# EAGLE design cblock (EAGLE 6.6.0)
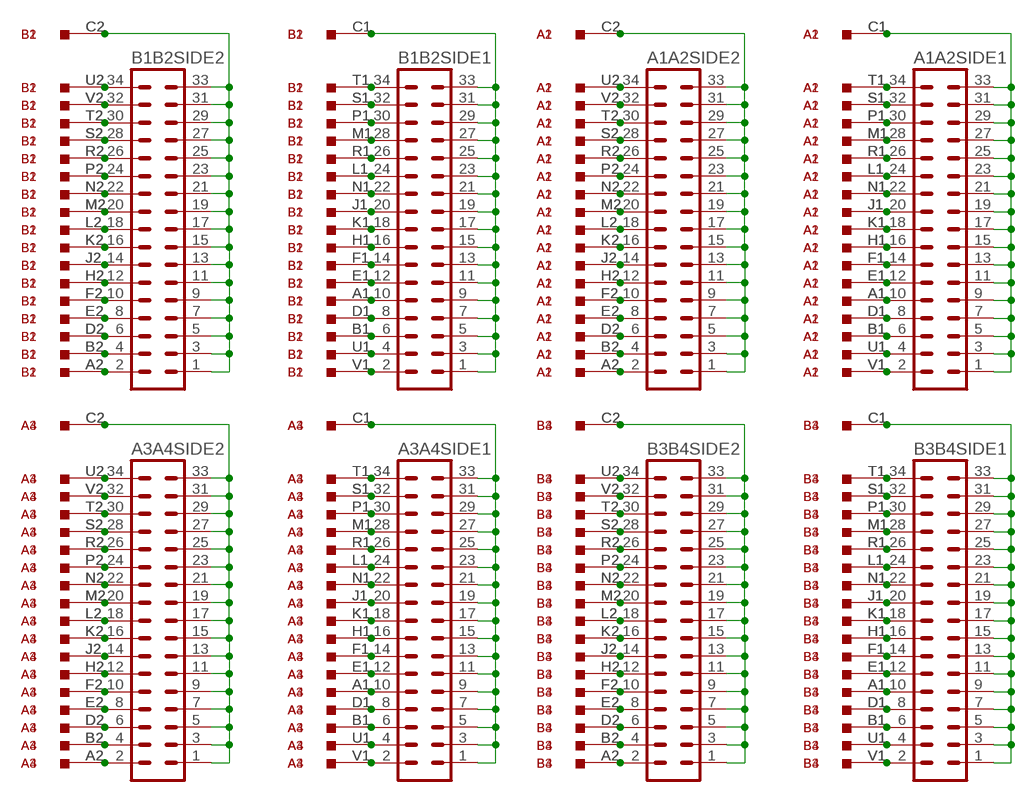
[diagram p0: schematic, sheet 1]

## Parts
A1  M916  [H807]
A1A2SIDE1  MA17-2  [MA17-2]
A1A2SIDE2  MA17-2  [MA17-2]
A2  M916  [H807]
A3  M916  [H807]
A3A4SIDE1  MA17-2  [MA17-2]
A3A4SIDE2  MA17-2  [MA17-2]
A4  M916  [H807]
B1  M916  [H807]
B1B2SIDE1  MA17-2  [MA17-2]
B1B2SIDE2  MA17-2  [MA17-2]
B2  M916  [H807]
B3  M916  [H807]
B3B4SIDE1  MA17-2  [MA17-2]
B3B4SIDE2  MA17-2  [MA17-2]
B4  M916  [H807]

## Nets
N$1: B1.C2 B1B2SIDE2.1 B1B2SIDE2.3 B1B2SIDE2.5 B1B2SIDE2.7 B1B2SIDE2.9 B1B2SIDE2.11 B1B2SIDE2.13 B1B2SIDE2.15 B1B2SIDE2.17 B1B2SIDE2.19 B1B2SIDE2.21 B1B2SIDE2.23 B1B2SIDE2.25 B1B2SIDE2.27 B1B2SIDE2.29 B1B2SIDE2.31 B1B2SIDE2.33 B2.C2
N$2: B1.A2 B1B2SIDE2.2 B2.A2
N$3: B1.B2 B1B2SIDE2.4 B2.B2
N$4: B1.D2 B1B2SIDE2.6 B2.D2
N$5: B1.E2 B1B2SIDE2.8 B2.E2
N$6: B1.F2 B1B2SIDE2.10 B2.F2
N$7: B1.H2 B1B2SIDE2.12 B2.H2
N$8: B1.J2 B1B2SIDE2.14 B2.J2
N$9: B1.K2 B1B2SIDE2.16 B2.K2
N$10: B1.L2 B1B2SIDE2.18 B2.L2
N$11: B1.M2 B1B2SIDE2.20 B2.M2
N$12: B1.N2 B1B2SIDE2.22 B2.N2
N$13: B1.P2 B1B2SIDE2.24 B2.P2
N$14: B1.R2 B1B2SIDE2.26 B2.R2
N$15: B1.S2 B1B2SIDE2.28 B2.S2
N$16: B1.T2 B1B2SIDE2.30 B2.T2
N$17: B1.U2 B1B2SIDE2.34 B2.U2
N$18: B1.V2 B1B2SIDE2.32 B2.V2
N$19: B1.A1 B1B2SIDE1.10 B2.A1
N$20: B1.B1 B1B2SIDE1.6 B2.B1
N$21: B1.D1 B1B2SIDE1.8 B2.D1
N$22: B1.E1 B1B2SIDE1.12 B2.E1
N$23: B1.F1 B1B2SIDE1.14 B2.F1
N$24: B1.H1 B1B2SIDE1.16 B2.H1
N$25: B1.J1 B1B2SIDE1.20 B2.J1
N$26: B1.K1 B1B2SIDE1.18 B2.K1
N$27: B1.L1 B1B2SIDE1.24 B2.L1
N$28: B1.M1 B1B2SIDE1.28 B2.M1
N$29: B1.N1 B1B2SIDE1.22 B2.N1
N$30: B1.P1 B1B2SIDE1.30 B2.P1
N$31: B1.R1 B1B2SIDE1.26 B2.R1
N$32: B1.S1 B1B2SIDE1.32 B2.S1
N$33: B1.T1 B1B2SIDE1.34 B2.T1
N$34: B1.U1 B1B2SIDE1.4 B2.U1
N$35: B1.V1 B1B2SIDE1.2 B2.V1
N$36: B1.C1 B1B2SIDE1.1 B1B2SIDE1.3 B1B2SIDE1.5 B1B2SIDE1.7 B1B2SIDE1.9 B1B2SIDE1.11 B1B2SIDE1.13 B1B2SIDE1.15 B1B2SIDE1.17 B1B2SIDE1.19 B1B2SIDE1.21 B1B2SIDE1.23 B1B2SIDE1.25 B1B2SIDE1.27 B1B2SIDE1.29 B1B2SIDE1.31 B1B2SIDE1.33 B2.C1
N$37: A1.C2 A1A2SIDE2.1 A1A2SIDE2.3 A1A2SIDE2.5 A1A2SIDE2.7 A1A2SIDE2.9 A1A2SIDE2.11 A1A2SIDE2.13 A1A2SIDE2.15 A1A2SIDE2.17 A1A2SIDE2.19 A1A2SIDE2.21 A1A2SIDE2.23 A1A2SIDE2.25 A1A2SIDE2.27 A1A2SIDE2.29 A1A2SIDE2.31 A1A2SIDE2.33 A2.C2
N$38: A1.A2 A1A2SIDE2.2 A2.A2
N$39: A1.B2 A1A2SIDE2.4 A2.B2
N$40: A1.D2 A1A2SIDE2.6 A2.D2
N$41: A1.E2 A1A2SIDE2.8 A2.E2
N$42: A1.F2 A1A2SIDE2.10 A2.F2
N$43: A1.H2 A1A2SIDE2.12 A2.H2
N$44: A1.J2 A1A2SIDE2.14 A2.J2
N$45: A1.K2 A1A2SIDE2.16 A2.K2
N$46: A1.L2 A1A2SIDE2.18 A2.L2
N$47: A1.M2 A1A2SIDE2.20 A2.M2
N$48: A1.N2 A1A2SIDE2.22 A2.N2
N$49: A1.P2 A1A2SIDE2.24 A2.P2
N$50: A1.R2 A1A2SIDE2.26 A2.R2
N$51: A1.S2 A1A2SIDE2.28 A2.S2
N$52: A1.T2 A1A2SIDE2.30 A2.T2
N$53: A1.U2 A1A2SIDE2.34 A2.U2
N$54: A1.V2 A1A2SIDE2.32 A2.V2
N$55: A1.A1 A1A2SIDE1.10 A2.A1
N$56: A1.B1 A1A2SIDE1.6 A2.B1
N$57: A1.D1 A1A2SIDE1.8 A2.D1
N$58: A1.E1 A1A2SIDE1.12 A2.E1
N$59: A1.F1 A1A2SIDE1.14 A2.F1
N$60: A1.H1 A1A2SIDE1.16 A2.H1
N$61: A1.J1 A1A2SIDE1.20 A2.J1
N$62: A1.K1 A1A2SIDE1.18 A2.K1
N$63: A1.L1 A1A2SIDE1.24 A2.L1
N$64: A1.M1 A1A2SIDE1.28 A2.M1
N$65: A1.N1 A1A2SIDE1.22 A2.N1
N$66: A1.P1 A1A2SIDE1.30 A2.P1
N$67: A1.R1 A1A2SIDE1.26 A2.R1
N$68: A1.S1 A1A2SIDE1.32 A2.S1
N$69: A1.T1 A1A2SIDE1.34 A2.T1
N$70: A1.U1 A1A2SIDE1.4 A2.U1
N$71: A1.V1 A1A2SIDE1.2 A2.V1
N$72: A1.C1 A1A2SIDE1.1 A1A2SIDE1.3 A1A2SIDE1.5 A1A2SIDE1.7 A1A2SIDE1.9 A1A2SIDE1.11 A1A2SIDE1.13 A1A2SIDE1.15 A1A2SIDE1.17 A1A2SIDE1.19 A1A2SIDE1.21 A1A2SIDE1.23 A1A2SIDE1.25 A1A2SIDE1.27 A1A2SIDE1.29 A1A2SIDE1.31 A1A2SIDE1.33 A2.C1
N$145: A3.C2 A3A4SIDE2.1 A3A4SIDE2.3 A3A4SIDE2.5 A3A4SIDE2.7 A3A4SIDE2.9 A3A4SIDE2.11 A3A4SIDE2.13 A3A4SIDE2.15 A3A4SIDE2.17 A3A4SIDE2.19 A3A4SIDE2.21 A3A4SIDE2.23 A3A4SIDE2.25 A3A4SIDE2.27 A3A4SIDE2.29 A3A4SIDE2.31 A3A4SIDE2.33 A4.C2
N$146: A3.A2 A3A4SIDE2.2 A4.A2
N$147: A3.B2 A3A4SIDE2.4 A4.B2
N$148: A3.D2 A3A4SIDE2.6 A4.D2
N$149: A3.E2 A3A4SIDE2.8 A4.E2
N$150: A3.F2 A3A4SIDE2.10 A4.F2
N$151: A3.H2 A3A4SIDE2.12 A4.H2
N$152: A3.J2 A3A4SIDE2.14 A4.J2
N$153: A3.K2 A3A4SIDE2.16 A4.K2
N$154: A3.L2 A3A4SIDE2.18 A4.L2
N$155: A3.M2 A3A4SIDE2.20 A4.M2
N$156: A3.N2 A3A4SIDE2.22 A4.N2
N$157: A3.P2 A3A4SIDE2.24 A4.P2
N$158: A3.R2 A3A4SIDE2.26 A4.R2
N$159: A3.S2 A3A4SIDE2.28 A4.S2
N$160: A3.T2 A3A4SIDE2.30 A4.T2
N$161: A3.U2 A3A4SIDE2.34 A4.U2
N$162: A3.V2 A3A4SIDE2.32 A4.V2
N$163: A3.A1 A3A4SIDE1.10 A4.A1
N$164: A3.B1 A3A4SIDE1.6 A4.B1
N$165: A3.D1 A3A4SIDE1.8 A4.D1
N$166: A3.E1 A3A4SIDE1.12 A4.E1
N$167: A3.F1 A3A4SIDE1.14 A4.F1
N$168: A3.H1 A3A4SIDE1.16 A4.H1
N$169: A3.J1 A3A4SIDE1.20 A4.J1
N$170: A3.K1 A3A4SIDE1.18 A4.K1
N$171: A3.L1 A3A4SIDE1.24 A4.L1
N$172: A3.M1 A3A4SIDE1.28 A4.M1
N$173: A3.N1 A3A4SIDE1.22 A4.N1
N$174: A3.P1 A3A4SIDE1.30 A4.P1
N$175: A3.R1 A3A4SIDE1.26 A4.R1
N$176: A3.S1 A3A4SIDE1.32 A4.S1
N$177: A3.T1 A3A4SIDE1.34 A4.T1
N$178: A3.U1 A3A4SIDE1.4 A4.U1
N$179: A3.V1 A3A4SIDE1.2 A4.V1
N$180: A3.C1 A3A4SIDE1.1 A3A4SIDE1.3 A3A4SIDE1.5 A3A4SIDE1.7 A3A4SIDE1.9 A3A4SIDE1.11 A3A4SIDE1.13 A3A4SIDE1.15 A3A4SIDE1.17 A3A4SIDE1.19 A3A4SIDE1.21 A3A4SIDE1.23 A3A4SIDE1.25 A3A4SIDE1.27 A3A4SIDE1.29 A3A4SIDE1.31 A3A4SIDE1.33 A4.C1
N$253: B3.C2 B3B4SIDE2.1 B3B4SIDE2.3 B3B4SIDE2.5 B3B4SIDE2.7 B3B4SIDE2.9 B3B4SIDE2.11 B3B4SIDE2.13 B3B4SIDE2.15 B3B4SIDE2.17 B3B4SIDE2.19 B3B4SIDE2.21 B3B4SIDE2.23 B3B4SIDE2.25 B3B4SIDE2.27 B3B4SIDE2.29 B3B4SIDE2.31 B3B4SIDE2.33 B4.C2
N$254: B3.A2 B3B4SIDE2.2 B4.A2
N$255: B3.B2 B3B4SIDE2.4 B4.B2
N$256: B3.D2 B3B4SIDE2.6 B4.D2
N$257: B3.E2 B3B4SIDE2.8 B4.E2
N$258: B3.F2 B3B4SIDE2.10 B4.F2
N$259: B3.H2 B3B4SIDE2.12 B4.H2
N$260: B3.J2 B3B4SIDE2.14 B4.J2
N$261: B3.K2 B3B4SIDE2.16 B4.K2
N$262: B3.L2 B3B4SIDE2.18 B4.L2
N$263: B3.M2 B3B4SIDE2.20 B4.M2
N$264: B3.N2 B3B4SIDE2.22 B4.N2
N$265: B3.P2 B3B4SIDE2.24 B4.P2
N$266: B3.R2 B3B4SIDE2.26 B4.R2
N$267: B3.S2 B3B4SIDE2.28 B4.S2
N$268: B3.T2 B3B4SIDE2.30 B4.T2
N$269: B3.U2 B3B4SIDE2.34 B4.U2
N$270: B3.V2 B3B4SIDE2.32 B4.V2
N$271: B3.A1 B3B4SIDE1.10 B4.A1
N$272: B3.B1 B3B4SIDE1.6 B4.B1
N$273: B3.D1 B3B4SIDE1.8 B4.D1
N$274: B3.E1 B3B4SIDE1.12 B4.E1
N$275: B3.F1 B3B4SIDE1.14 B4.F1
N$276: B3.H1 B3B4SIDE1.16 B4.H1
N$277: B3.J1 B3B4SIDE1.20 B4.J1
N$278: B3.K1 B3B4SIDE1.18 B4.K1
N$279: B3.L1 B3B4SIDE1.24 B4.L1
N$280: B3.M1 B3B4SIDE1.28 B4.M1
N$281: B3.N1 B3B4SIDE1.22 B4.N1
N$282: B3.P1 B3B4SIDE1.30 B4.P1
N$283: B3.R1 B3B4SIDE1.26 B4.R1
N$284: B3.S1 B3B4SIDE1.32 B4.S1
N$285: B3.T1 B3B4SIDE1.34 B4.T1
N$286: B3.U1 B3B4SIDE1.4 B4.U1
N$287: B3.V1 B3B4SIDE1.2 B4.V1
N$288: B3.C1 B3B4SIDE1.1 B3B4SIDE1.3 B3B4SIDE1.5 B3B4SIDE1.7 B3B4SIDE1.9 B3B4SIDE1.11 B3B4SIDE1.13 B3B4SIDE1.15 B3B4SIDE1.17 B3B4SIDE1.19 B3B4SIDE1.21 B3B4SIDE1.23 B3B4SIDE1.25 B3B4SIDE1.27 B3B4SIDE1.29 B3B4SIDE1.31 B3B4SIDE1.33 B4.C1

## Library data of the parts
A1-A4 B1-B4 = dec-m:M916: Simple 36 pin connector/wire cable
A1A2SIDE1 A1A2SIDE2 A3A4SIDE1 A3A4SIDE2 B1B2SIDE1 B1B2SIDE2 B3B4SIDE1 B3B4SIDE2 = con-lstb:MA17-2: PIN HEADER; OC_FARNELL: unknown; OC_NEWARK: unknown

## Net classes
1 Power: width 0.305 mm, clearance 0.305 mm

## Board
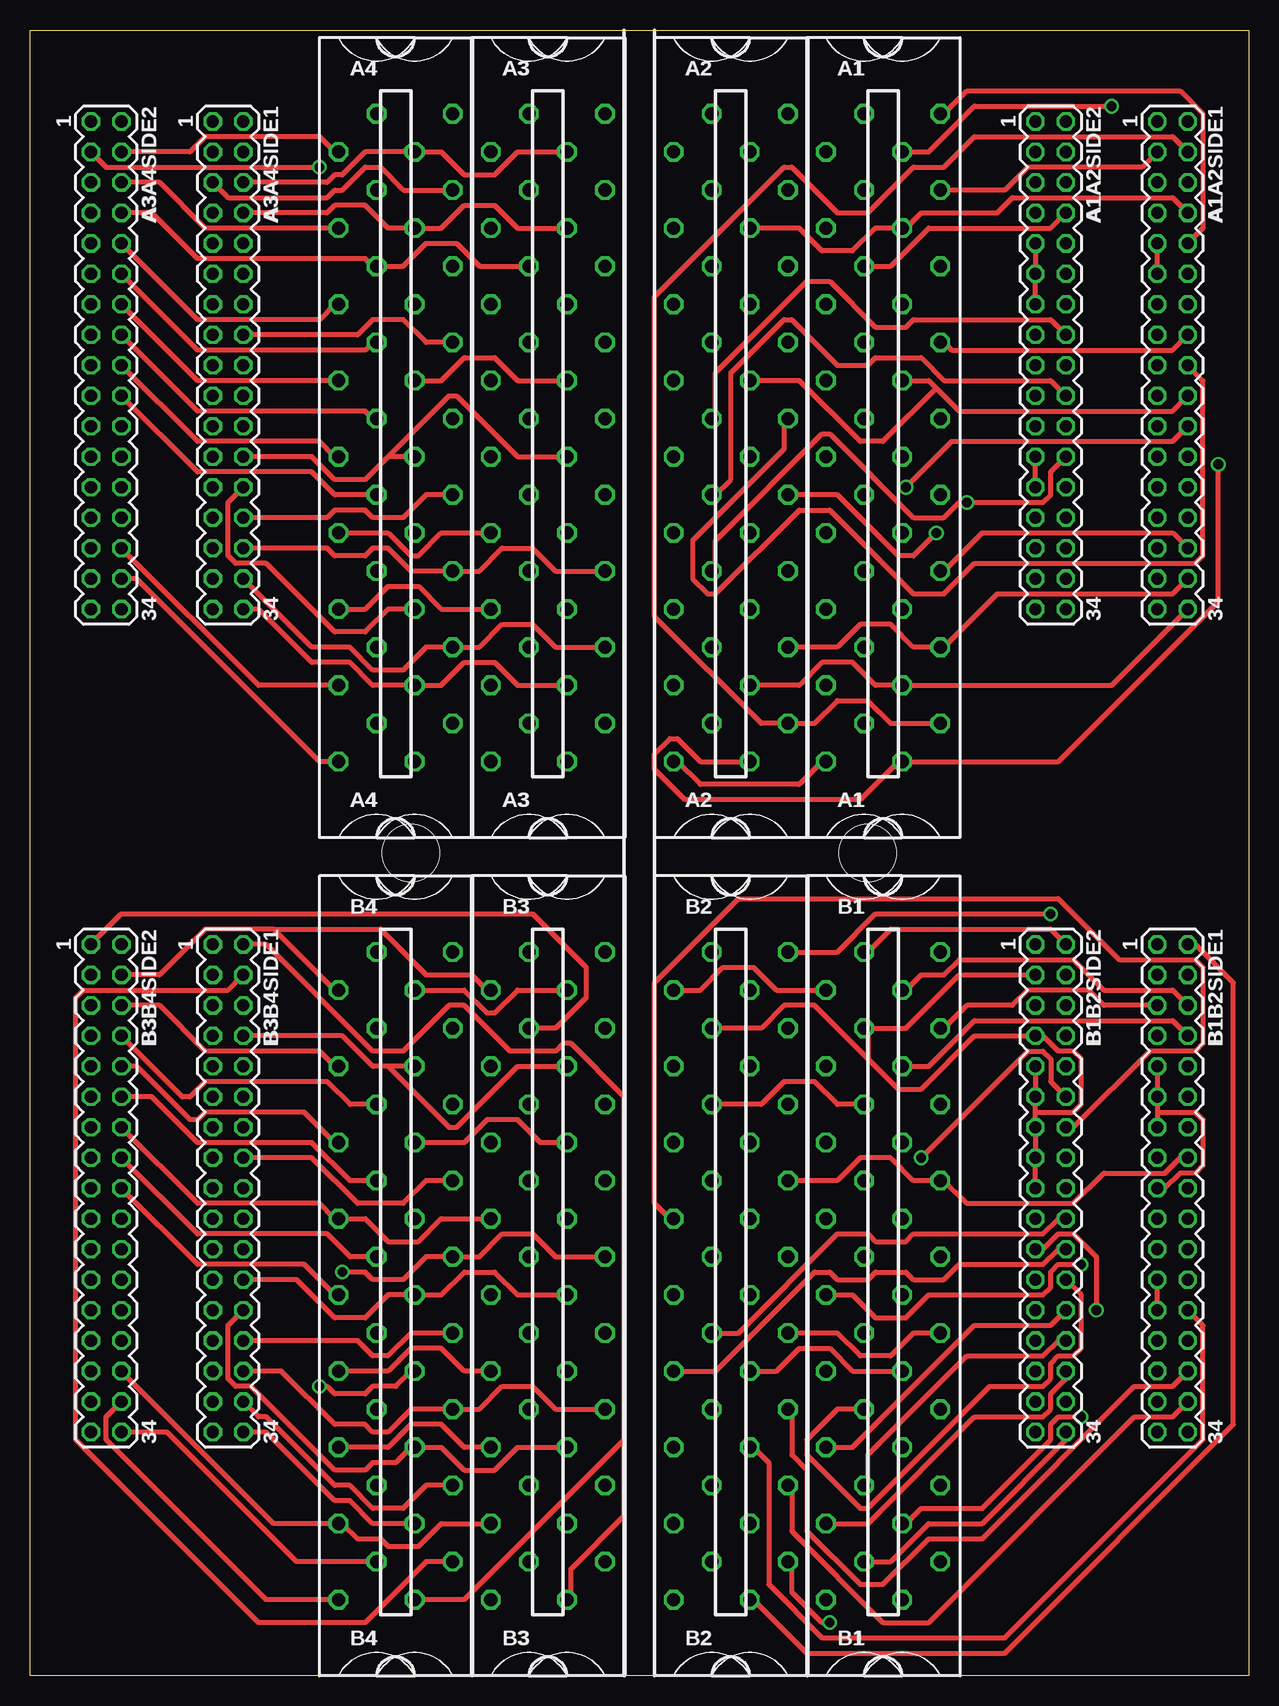
[diagram p1: board, top side]
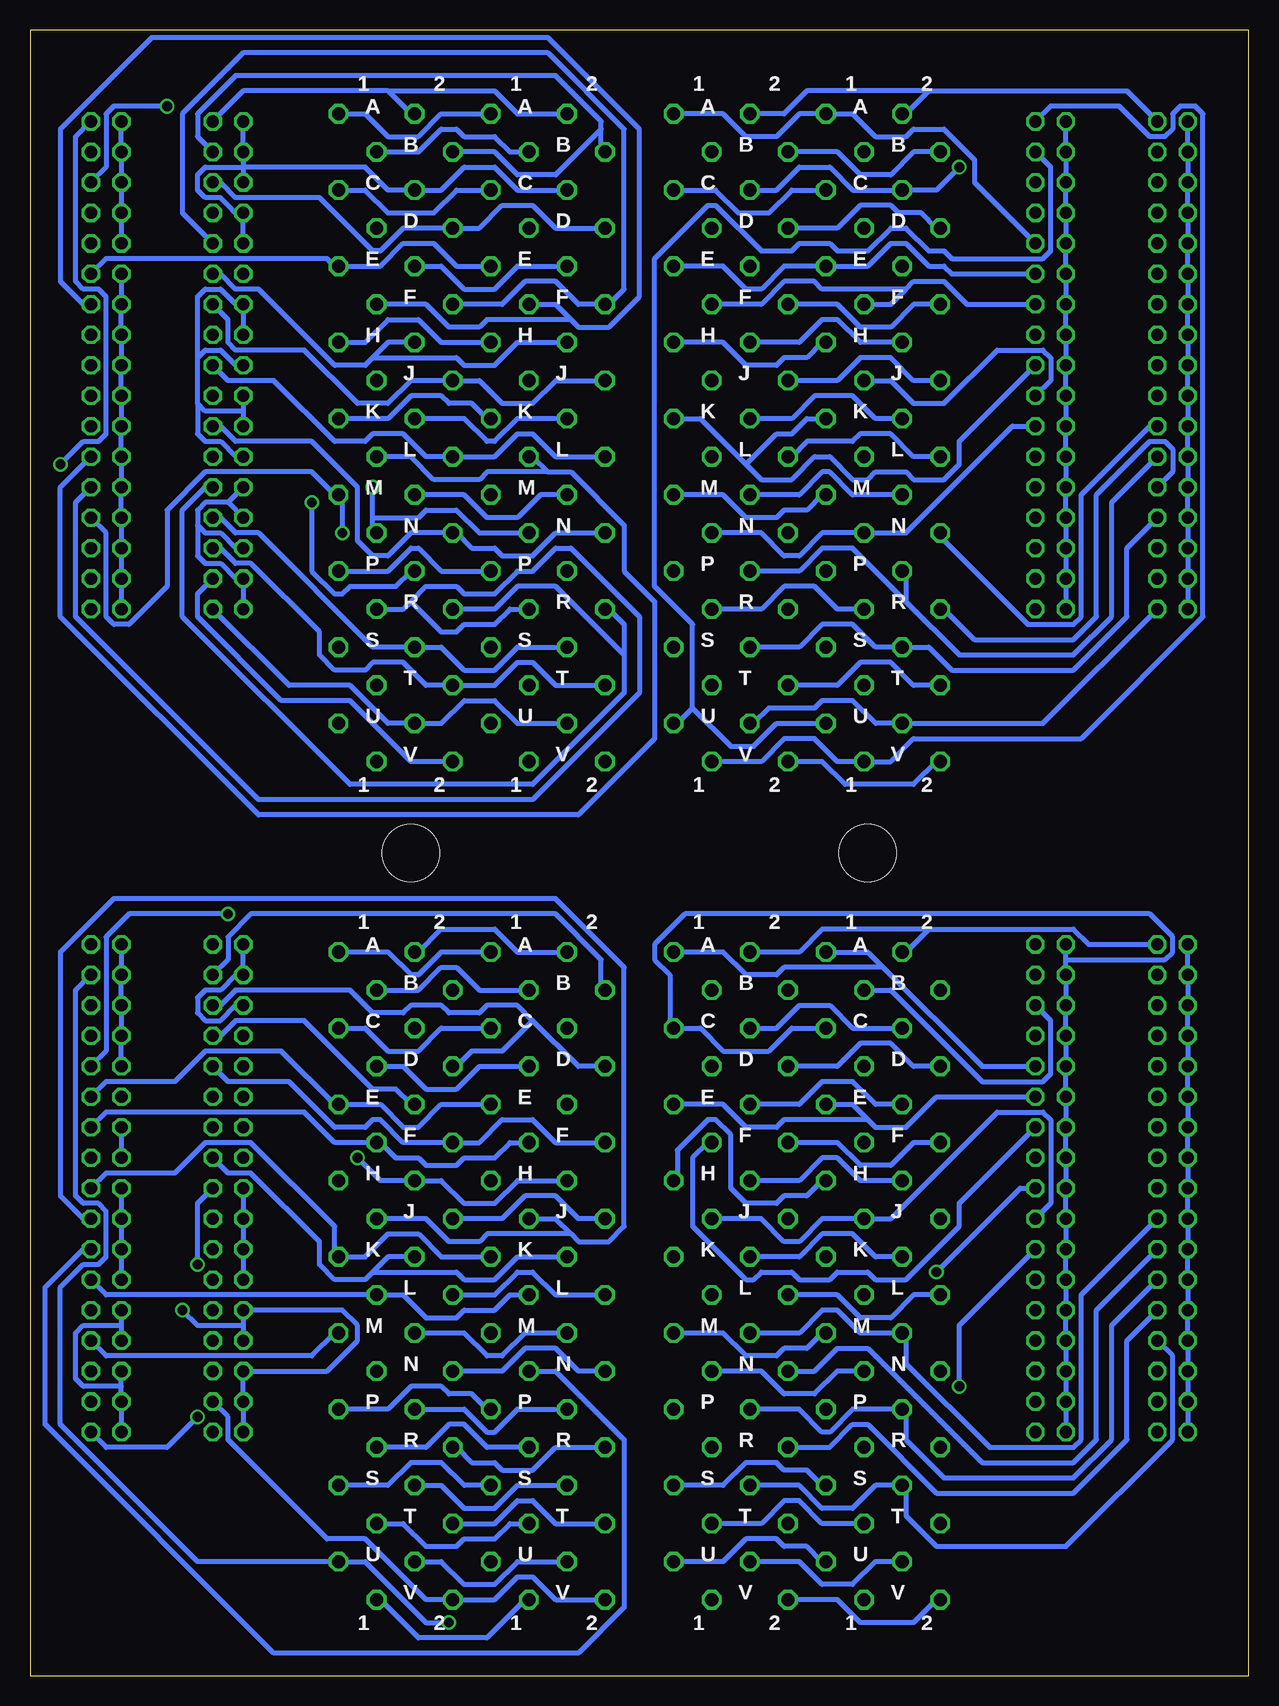
[diagram p2: board, bottom side, seen from below]

Size 101.6 x 137.16 mm. Coordinates in mm from the lower left corner, seen from the top.
Outline: 101.6,0 52.07,0 49.53,0 0,0 0,137.16 49.53,137.16 52.07,137.16 101.6,137.16 101.6,0
Copper layers (1+16): Top 0.035mm / dielectric 1.5mm / Bottom 0.035mm
Design rules "16mils": minimum track width 16mil, minimum drill 32mil, track to track 15mil, track to pad 10mil, pad to pad 10mil, via to via 10mil, smd to smd 10mil, copper to edge 13mil, drill to drill 10mil, minimum pad ring 10mil, minimum via ring 8mil, stop-mask expansion 0mil, vias tented up to drill 0mil, thermal gap 10mil
Holes 4.78 mm at 31.75,68.58 69.85,68.58

### Footprints (pad centres in the part's own frame; a part is rotated, then mirrored left to right if it is on the bottom)
H807 = drill 1.092 octagon: A1 4.763,28.575; A2 -1.587,28.575; B1 1.587,25.4; B2 -4.763,25.4; C1 4.763,22.225; C2 -1.587,22.225; D1 1.587,19.05; D2 -4.763,19.05; E1 4.763,15.875; E2 -1.587,15.875; F1 1.587,12.7; F2 -4.763,12.7; H1 4.763,9.525; H2 -1.587,9.525; J1 1.587,6.35; J2 -4.763,6.35; K1 4.763,3.175; K2 -1.587,3.175; L1 1.587,0; L2 -4.763,0; M1 4.763,-3.175; M2 -1.587,-3.175; N1 1.587,-6.35; N2 -4.763,-6.35; P1 4.763,-9.525; P2 -1.587,-9.525; R1 1.587,-12.7; R2 -4.763,-12.7; S1 4.763,-15.875; S2 -1.587,-15.875; T1 1.587,-19.05; T2 -4.763,-19.05; U1 4.763,-22.225; U2 -1.587,-22.225; V1 1.587,-25.4; V2 -4.763,-25.4
MA17-2 = drill 1.016 octagon: 1 -20.32,-1.27; 2 -20.32,1.27; 3 -17.78,-1.27; 4 -17.78,1.27; 5 -15.24,-1.27; 6 -15.24,1.27; 7 -12.7,-1.27; 8 -12.7,1.27; 9 -10.16,-1.27; 10 -10.16,1.27; 11 -7.62,-1.27; 12 -7.62,1.27; 13 -5.08,-1.27; 14 -5.08,1.27; 15 -2.54,-1.27; 16 -2.54,1.27; 17 0,-1.27; 18 0,1.27; 19 2.54,-1.27; 20 2.54,1.27; 21 5.08,-1.27; 22 5.08,1.27; 23 7.62,-1.27; 24 7.62,1.27; 25 10.16,-1.27; 26 10.16,1.27; 27 12.7,-1.27; 28 12.7,1.27; 29 15.24,-1.27; 30 15.24,1.27; 31 17.78,-1.27; 32 17.78,1.27; 33 20.32,-1.27; 34 20.32,1.27

### Placement (x,y rotation side)
A1  71.12,101.6 0 top
A1A2SIDE1  95.25,109.22 270 top
A1A2SIDE2  85.09,109.22 270 top
A2  58.42,101.6 0 top
A3  43.18,101.6 0 top
A3A4SIDE1  16.51,109.22 270 top
A3A4SIDE2  6.35,109.22 270 top
A4  30.48,101.6 0 top
B1  71.12,31.75 0 top
B1B2SIDE1  95.25,40.64 270 top
B1B2SIDE2  85.09,40.64 270 top
B2  58.42,31.75 0 top
B3  43.18,31.75 0 top
B3B4SIDE1  16.51,40.64 270 top
B3B4SIDE2  6.35,40.64 270 top
B4  30.48,31.75 0 top

### Tracks (layer width: path | path; a pad name or v marks a point on that pad's centre or on a via)
N$1  (via drill 0.81)
  Top 0.406: 69.85,51.44 72.39,48.9 74.3,48.9 78.74,53.34 B1B2SIDE2.7 84.45,53.34 85.72,52.07 87,52.07 87.63,51.44 87.63,47.62 87,46.99 83.82,46.99 | 69.85,53.98 69.85,51.44 | B2.C2 60.96,53.98 62.87,55.88 65.41,55.88 69.85,51.44 | B1B2SIDE2.3 77.47,58.42 73.03,53.98 69.85,53.98 | 69.85,53.98 B1.C2 | B1B2SIDE2.9 B1B2SIDE2.11 83.82,46.99 | B1B2SIDE2.17 B1B2SIDE2.15 B1B2SIDE2.13 83.82,46.99 | v88.9,30.48 88.9,34.92 87,36.83 85.72,36.83 84.45,35.56 B1B2SIDE2.21
  Bottom 0.406: B1B2SIDE2.5 84.45,55.88 85.72,54.61 87,54.61 87.63,55.24 87.63,56.52 87,57.15 85.72,57.15 84.45,58.42 B1B2SIDE2.3 B1B2SIDE2.1 | 83.82,29.21 B1B2SIDE2.25 75.56,30.48 74.3,29.21 74.3,27.94 76.83,25.4 B1B2SIDE2.29 B1B2SIDE2.31 B1B2SIDE2.33 | 83.82,29.21 B1B2SIDE2.27 | B1B2SIDE2.23 B1B2SIDE2.21 B1B2SIDE2.19 B1B2SIDE2.17 | 83.82,29.21 87.63,29.21 v88.9,30.48
N$2
  Top 0.406: B1B2SIDE2.2 85.09,62.23 71.75,62.23 69.85,60.33 B1.A2
  Bottom 0.406: B2.A2 60.96,60.33 62.87,62.23 67.31,62.23 69.22,60.33 B1.A2
N$3
  Top 0.406: B1.B2 62.23,57.15 60.33,59.05 57.78,59.05 55.88,57.15 B2.B2
  Bottom 0.406: B1B2SIDE2.4 85.09,59.69 85.09,61.59 83.19,63.5 57.78,63.5 53.98,59.69 53.98,57.15 B2.B2
N$4
  Bottom 0.406: B1B2SIDE2.6 85.72,55.88 84.45,57.15 74.93,57.15 73.03,55.24 70.48,55.24 69.85,55.88 67.31,55.88 66.67,55.24 64.14,55.24 63.5,55.88 60.96,55.88 59.69,54.61 | 59.69,54.61 55.88,50.8 B2.D2 | 59.69,54.61 62.23,52.07 64.77,52.07 66.04,50.8 B1.D2
N$5
  Top 0.406: B2.E2 60.96,47.62 62.87,49.53 65.41,49.53 67.31,47.62 B1.E2
  Bottom 0.406: B1B2SIDE2.8 85.72,53.34 84.45,54.61 78.74,54.61 73.03,48.9 71.12,48.9 69.85,47.62 B1.E2
N$6
  Bottom 0.406: B1B2SIDE2.10 85.09,49.53 80.01,49.53 76.2,45.72 73.66,45.72 73.03,46.35 72.39,46.35 70.48,44.45 B1.F2 64.14,44.45 62.23,46.35 59.69,46.35 57.78,44.45 B2.F2
N$7  (via drill 0.81)
  Top 0.406: B1B2SIDE2.12 85.09,49.53 85.09,51.44 84.45,52.07 83.19,52.07 v74.3,43.18
  Bottom 0.406: v74.3,43.18 72.39,41.27 B1.H2 67.31,41.27 65.41,39.37 62.87,39.37 60.96,41.27 B2.H2
N$8
  Top 0.406: B1B2SIDE2.14 87,45.72 93.34,52.07 97.16,52.07 97.79,52.7 97.79,59.05 97.16,59.69 90.81,59.69 85.72,64.77 59.05,64.77 52.07,57.78 52.07,39.37 53.34,38.1 B2.J2
  Bottom 0.406: B1.J2 62.23,38.1 60.33,40.01 57.78,40.01 55.88,38.1 B2.J2
N$9
  Bottom 0.406: B1B2SIDE2.16 85.09,41.91 83.19,41.91 77.47,36.2 77.47,34.29 76.2,33.02 73.66,33.02 73.03,33.66 | 73.03,33.66 71.75,34.92 B1.K2 | B2.K2 60.96,34.92 62.87,33.02 65.41,33.02 66.04,33.66 73.03,33.66
N$10  (via drill 0.81)
  Top 0.406: v87.63,34.29 85.72,34.29 85.09,33.66 85.09,32.38 84.45,31.75 74.93,31.75 73.03,29.84 70.48,29.84 68.58,31.75 B1.L2
  Bottom 0.406: B1B2SIDE2.18 87.63,39.37 v87.63,34.29 | B2.L2 57.78,31.75 59.69,33.66 60.96,33.66 62.87,31.75 B1.L2
N$11
  Top 0.406: B1B2SIDE2.20 85.72,38.1 84.45,36.83 73.66,36.83 73.03,36.2 70.48,36.2 69.85,36.83 67.31,36.83 59.05,28.57 B2.M2
  Bottom 0.406: B1.M2 65.41,28.57 63.5,26.67 62.23,26.67 60.33,28.57 B2.M2
N$12
  Top 0.406: B1B2SIDE2.22 85.72,35.56 84.45,34.29 77.47,34.29 76.2,33.02 73.66,33.02 73.03,33.66 70.48,33.66 69.85,33.02 67.31,33.02 66.67,33.66 65.41,33.66 57.15,25.4 B2.N2
  Bottom 0.406: B1.N2 62.23,25.4 60.33,27.3 57.78,27.3 55.88,25.4 B2.N2
N$13
  Top 0.406: B1B2SIDE2.24 87.63,31.75 87.63,27.3 87,26.67 85.72,26.67 85.09,26.04 85.09,24.77 84.45,24.13 80.01,24.13 69.85,13.97 69.22,13.97 64.77,18.41 64.77,19.68 67.31,22.23 B1.P2
  Bottom 0.406: B2.P2 60.96,22.23 62.87,20.32 63.5,20.32 65.41,22.23 B1.P2
N$14
  Top 0.406: B1B2SIDE2.26 85.09,29.21 78.74,29.21 68.58,19.05 B1.R2
  Bottom 0.406: B2.R2 57.78,19.05 59.69,17.14 62.23,17.14 62.87,17.78 64.77,17.78 66.04,19.05 B1.R2
N$15
  Top 0.406: B1B2SIDE2.28 85.72,27.94 84.45,26.67 78.11,26.67 69.85,18.41 69.85,15.88 B1.S2
  Bottom 0.406: B2.S2 60.96,15.88 62.87,13.97 65.41,13.97 67.31,15.88 B1.S2
N$16
  Top 0.406: B1B2SIDE2.30 86.36,24.77 85.09,23.5 85.09,22.23 84.45,21.59 78.74,21.59 69.85,12.7 B1.T2
  Bottom 0.406: B2.T2 57.78,12.7 59.69,14.61 60.96,14.61 62.87,12.7 B1.T2
N$17
  Top 0.406: B1B2SIDE2.34 86.36,19.68 79.38,12.7 74.93,12.7 71.75,9.53 B1.U2
  Bottom 0.406: B2.U2 60.96,9.53 62.87,7.62 65.41,7.62 67.31,9.53 B1.U2
N$18
  Bottom 0.406: B1B2SIDE2.32 85.09,21.59 85.09,19.68 76.83,11.43 73.66,11.43 68.58,6.35 B1.V2 62.87,6.35 60.96,8.26 59.69,8.26 57.78,6.35 B2.V2
N$19  (via drill 0.81)
  Top 0.406: v85.09,63.5 70.48,63.5 67.31,60.33 B2.A1
  Bottom 0.406: B1B2SIDE1.10 95.25,52.07 95.25,61.59 93.34,63.5 v85.09,63.5 | B1.A1 71.75,60.33 69.85,58.42 69.22,58.42 67.31,60.33 B2.A1
N$20
  Top 0.406: B1B2SIDE1.6 95.25,57.15 89.53,57.15 87,59.69 77.47,59.69 76.2,58.42 74.3,58.42 73.03,57.15 B1.B1
  Bottom 0.406: B2.B1 64.14,57.15 66.04,59.05 67.31,59.05 69.22,57.15 B1.B1
N$21
  Top 0.406: B1B2SIDE1.8 95.25,54.61 78.74,54.61 74.93,50.8 B1.D1
  Bottom 0.406: B2.D1 64.14,50.8 66.04,48.9 68.58,48.9 70.48,50.8 B1.D1
N$22
  Bottom 0.406: B1B2SIDE1.12 95.25,49.53 89.53,49.53 87,52.07 80.64,52.07 76.2,47.62 B1.E1 72.39,47.62 70.48,45.72 69.22,45.72 67.31,47.62 B2.E1
N$23
  Bottom 0.406: B1B2SIDE1.14 95.25,46.99 78.74,46.99 76.2,44.45 B1.F1 72.39,44.45 71.12,43.18 69.22,43.18 68.58,42.55 66.04,42.55 65.41,43.18 62.87,43.18 61.59,44.45 B2.F1
N$24
  Top 0.406: B1B2SIDE1.16 95.89,43.18 94.61,41.91 89.53,41.91 87,39.37 78.11,39.37 76.2,41.27 B1.H1 73.66,41.27 71.75,43.18 69.22,43.18 67.31,41.27 B2.H1
N$25
  Bottom 0.406: B1B2SIDE1.20 97.16,38.1 99.06,40.01 99.06,60.33 94.61,64.77 57.78,64.77 52.07,59.05 52.07,37.47 53.34,36.2 55.88,36.2 56.52,36.83 | 56.52,36.83 57.78,38.1 B2.J1 | B1.J1 68.58,38.1 66.67,36.2 64.14,36.2 63.5,36.83 56.52,36.83
N$26
  Bottom 0.406: B1B2SIDE1.18 95.25,41.91 89.53,41.91 87,44.45 83.19,44.45 76.2,37.47 76.2,34.92 B1.K1 73.66,34.92 71.75,36.83 69.22,36.83 67.31,34.92 B2.K1
N$27
  Bottom 0.406: B1B2SIDE1.24 95.25,31.75 B1.L1 70.48,31.75 68.58,29.84 66.04,29.84 65.41,30.48 62.87,30.48 61.59,31.75 B2.L1
N$28
  Top 0.406: B2.M1 67.31,28.57 69.22,26.67 71.75,26.67 73.66,28.57 B1.M1
  Bottom 0.406: B1B2SIDE1.28 95.25,26.67 78.11,26.67 76.2,28.57 B1.M1
N$29
  Top 0.406: B1.N1 68.58,25.4 66.67,27.3 64.14,27.3 62.23,25.4 B2.N1
  Bottom 0.406: B1B2SIDE1.22 97.16,35.56 100.33,32.38 100.33,20.95 81.28,1.91 55.88,1.91 52.07,5.71 52.07,19.68 57.78,25.4 B2.N1
N$30
  Top 0.406: B1B2SIDE1.30 95.25,24.13 92.08,24.13 79.38,11.43 74.93,11.43 71.12,7.62 69.22,7.62 64.77,12.06 64.77,17.14 63.5,18.41 63.5,22.23 B2.P1
  Bottom 0.406: B1.P1 71.75,22.23 69.85,24.13 67.31,24.13 66.67,23.5 64.77,23.5 63.5,22.23 B2.P1
N$31
  Top 0.406: B1B2SIDE1.26 97.79,29.21 97.79,19.68 81.28,3.17 66.04,3.17 61.59,7.62 61.59,17.78 60.33,19.05 B2.R1
  Bottom 0.406: B1.R1 68.58,19.05 66.67,20.95 65.41,20.95 63.5,19.05 B2.R1
N$32
  Top 0.406: B1B2SIDE1.32 95.25,21.59 92.08,21.59 74.93,4.45 71.12,4.45 63.5,12.06 63.5,15.88 B2.S1
  Bottom 0.406: B1.S1 71.75,15.88 69.85,17.78 67.31,17.78 65.41,15.88 B2.S1
N$33  (via drill 0.81)
  Top 0.406: v87.63,21.59 85.72,21.59 85.09,20.95 85.09,19.68 79.38,13.97 74.3,13.97 73.03,12.7 B1.T1
  Bottom 0.406: B1B2SIDE1.34 95.25,19.05 90.17,19.05 v87.63,21.59 | B2.T1 61.59,12.7 62.87,11.43 65.41,11.43 66.04,10.79 68.58,10.79 70.48,12.7 B1.T1
N$34  (via drill 0.81)
  Top 0.406: v66.67,4.45 66.04,4.45 63.5,6.99 63.5,9.53 B2.U1
  Bottom 0.406: B1B2SIDE1.4 97.79,57.15 97.79,40.01 97.16,39.37 95.89,39.37 95.25,38.73 95.25,34.92 95.89,34.29 97.16,34.29 99.06,32.38 99.06,20.95 87.63,9.53 B1.U1 73.66,9.53 68.58,4.45 v66.67,4.45
N$35
  Top 0.406: B1B2SIDE1.2 97.16,60.96 100.33,57.78 100.33,20.95 81.28,1.91 64.77,1.91 60.33,6.35 B2.V1
  Bottom 0.406: B1.V1 72.39,6.35 69.22,3.17 63.5,3.17 60.33,6.35 B2.V1
N$36
  Top 0.406: B1B2SIDE1.25 B1B2SIDE1.23 | B1B2SIDE1.9 B1B2SIDE1.11 93.98,46.99 | 93.98,46.99 B1B2SIDE1.13 | B1B2SIDE1.5 89.53,55.88 88.27,57.15 83.19,57.15 81.92,55.88 78.11,55.88 76.2,53.98 B1.C1 | B1B2SIDE1.17 94.61,40.64 95.89,41.91 97.16,41.91 97.79,42.55 97.79,46.35 97.16,46.99 93.98,46.99
  Bottom 0.406: B1B2SIDE1.23 B1B2SIDE1.21 B1B2SIDE1.19 B1B2SIDE1.17 | B1B2SIDE1.25 93.98,29.21 | 93.98,29.21 B1B2SIDE1.27 | B1B2SIDE1.33 B1B2SIDE1.31 93.98,24.13 | 93.98,24.13 B1B2SIDE1.29 | 93.98,29.21 97.16,29.21 97.79,28.57 97.79,24.77 97.16,24.13 93.98,24.13 | B2.C1 67.31,53.98 69.22,52.07 71.75,52.07 73.66,53.98 B1.C1 | B1B2SIDE1.1 B1B2SIDE1.3 B1B2SIDE1.5 B1B2SIDE1.7 B1B2SIDE1.9 | B1B2SIDE1.13 B1B2SIDE1.15
N$37
  Top 0.406: A1A2SIDE2.25 A1A2SIDE2.23 | A1A2SIDE2.9 A1A2SIDE2.11 A1A2SIDE2.13
  Bottom 0.406: 83.82,125.73 A1A2SIDE2.3 A1A2SIDE2.1 | 83.82,125.73 A1A2SIDE2.5 | A2.C2 60.96,123.83 62.87,125.73 65.41,125.73 67.31,123.83 A1.C2 71.75,123.83 73.66,125.73 83.82,125.73 | A1A2SIDE2.33 A1A2SIDE2.31 84.45,91.44 85.72,92.71 87,92.71 87.63,93.34 87.63,95.89 | A1A2SIDE2.29 84.45,93.98 85.72,95.25 87,95.25 87.63,95.89 | 87.63,95.89 87.63,97.16 87,97.79 85.09,97.79 | A1A2SIDE2.25 85.09,97.79 | 85.09,97.79 A1A2SIDE2.27 | A1A2SIDE2.9 83.82,121.28 | A1A2SIDE2.15 A1A2SIDE2.13 84.45,114.3 85.72,115.57 87,115.57 87.63,114.94 87.63,109.86 | A1A2SIDE2.19 83.82,105.41 | 83.82,105.41 A1A2SIDE2.21 | A1A2SIDE2.17 84.45,109.22 85.72,110.49 87,110.49 87.63,109.86 | 87.63,106.05 87.63,109.86 | 87.63,106.05 87,105.41 83.82,105.41 | A1A2SIDE2.23 84.45,101.6 85.72,102.87 87,102.87 87.63,103.5 87.63,106.05 | 83.82,125.73 87,125.73 87.63,125.09 87.63,123.83 87,123.19 85.72,123.19 83.82,121.28 | 83.82,121.28 A1A2SIDE2.7
N$38
  Bottom 0.406: A1A2SIDE2.2 83.82,132.08 71.75,132.08 | 71.75,132.08 69.85,130.18 A1.A2 | A2.A2 60.96,130.18 62.87,132.08 71.75,132.08
N$39
  Bottom 0.406: A1A2SIDE2.4 87.63,128.27 87.63,130.18 84.45,133.35 57.78,133.35 53.98,129.54 53.98,128.91 | 53.98,128.91 53.98,127 A2.B2 | A1.B2 62.87,127 60.96,125.09 57.78,125.09 53.98,128.91
N$40
  Bottom 0.406: A1A2SIDE2.6 85.72,124.46 84.45,123.19 77.47,123.19 73.03,118.75 72.39,118.75 70.48,120.65 A1.D2 64.14,120.65 62.23,122.56 59.69,122.56 57.78,120.65 A2.D2
N$41
  Top 0.406: A1A2SIDE2.8 85.09,120.65 74.93,120.65 71.75,117.47 A1.E2
  Bottom 0.406: A2.E2 60.96,117.47 62.87,115.57 65.41,115.57 67.31,117.47 A1.E2
N$42
  Bottom 0.406: A1A2SIDE2.10 88.9,121.92 88.9,130.18 83.82,135.25 58.42,135.25 52.07,128.91 52.07,115.57 53.34,114.3 A2.F2 55.88,114.3 57.78,116.2 60.33,116.2 62.23,114.3 A1.F2
N$43
  Bottom 0.406: A1A2SIDE2.12 85.72,116.84 84.45,115.57 82.55,115.57 76.2,109.22 73.66,109.22 73.03,109.86 | 73.03,109.86 71.75,111.12 A1.H2 | A2.H2 60.96,111.12 62.87,109.22 65.41,109.22 66.04,109.86 73.03,109.86
N$44
  Bottom 0.406: A1A2SIDE2.14 85.09,113.03 85.09,111.12 84.45,110.49 78.74,110.49 74.3,106.05 71.75,106.05 69.85,107.95 A1.J2 64.14,107.95 62.23,106.05 59.69,106.05 57.78,107.95 A2.J2
N$45
  Top 0.406: A1A2SIDE2.16 85.09,113.03 73.66,113.03 73.03,112.39 70.48,112.39 66.67,116.2 64.77,116.2 57.15,108.58 57.15,104.78 A2.K2
  Bottom 0.406: A1.K2 65.41,104.78 63.5,102.87 62.87,102.87 60.96,104.78 A2.K2
N$46
  Bottom 0.406: A1A2SIDE2.18 85.09,107.95 81.28,107.95 76.2,102.87 73.66,102.87 73.03,103.5 70.48,103.5 68.58,101.6 A1.L2 62.87,101.6 60.96,103.5 59.69,103.5 57.78,101.6 A2.L2
N$47
  Top 0.406: A1A2SIDE2.20 85.09,107.95 76.2,107.95 74.3,109.86 70.48,109.86 69.85,109.22 67.31,109.22 63.5,113.03 62.87,113.03 58.42,108.58 58.42,99.69 57.15,98.42 A2.M2
  Bottom 0.406: A1.M2 65.41,98.42 63.5,96.52 60.96,96.52 59.05,98.42 A2.M2
N$48
  Bottom 0.406: A1A2SIDE2.22 85.72,104.14 84.45,102.87 78.11,102.87 74.3,99.06 74.3,94.61 73.03,93.34 71.75,93.34 69.85,95.25 A1.N2 66.04,95.25 64.77,93.98 62.87,93.98 62.23,93.34 59.69,93.34 57.78,95.25 A2.N2
N$49  (via drill 0.81)
  Top 0.406: A1A2SIDE2.24 85.09,100.33 85.09,98.42 84.45,97.79 v78.11,97.79 77.47,97.79 76.2,96.52 73.66,96.52 66.67,103.5 66.04,103.5 57.15,94.61 57.15,92.08 A2.P2
  Bottom 0.406: v78.11,97.79 78.11,92.08 76.2,90.17 75.56,90.17 74.93,90.81 71.12,90.81 69.85,92.08 A1.P2
N$50
  Bottom 0.406: A1A2SIDE2.26 87,99.06 88.9,97.16 88.9,88.27 74.93,74.3 59.69,74.3 52.07,81.92 52.07,85.09 | 52.07,85.09 52.07,87.63 53.34,88.9 A2.R2 | A1.R2 62.87,88.9 60.96,90.81 57.78,90.81 52.07,85.09
N$51
  Bottom 0.406: A1A2SIDE2.28 85.72,96.52 84.45,95.25 82.55,95.25 73.03,85.72 A1.S2 67.31,85.72 65.41,83.82 62.87,83.82 60.96,85.72 A2.S2
N$52
  Bottom 0.406: A1A2SIDE2.30 85.72,93.98 84.45,92.71 83.19,92.71 77.47,87 77.47,85.09 76.2,83.82 73.66,83.82 73.03,84.45 70.48,84.45 68.58,82.55 A1.T2 62.87,82.55 60.96,84.45 59.69,84.45 57.78,82.55 A2.T2
N$53
  Bottom 0.406: A1A2SIDE2.34 80.01,82.55 74.93,82.55 71.75,79.38 A1.U2 67.31,79.38 65.41,81.28 62.87,81.28 60.96,79.38 A2.U2
N$54
  Top 0.406: A2.V2 53.98,76.2 55.88,74.3 64.14,74.3 66.04,76.2 A1.V2
  Bottom 0.406: A1A2SIDE2.32 87.63,90.17 87.63,88.27 80.64,81.28 74.93,81.28 69.85,76.2 A1.V2
N$55
  Top 0.406: A1A2SIDE1.10 97.79,120.65 97.79,130.18 95.89,132.08 78.11,132.08 76.2,130.18 A1.A1
  Bottom 0.406: A2.A1 67.31,130.18 69.22,128.27 71.75,128.27 73.66,130.18 A1.A1
N$56  (via drill 0.81)
  Top 0.406: v90.17,130.81 78.74,130.81 74.93,127 A1.B1
  Bottom 0.406: A1A2SIDE1.6 95.25,125.73 95.25,130.18 94.61,130.81 v90.17,130.81 | A2.B1 61.59,127 62.87,128.27 65.41,128.27 66.04,128.91 67.31,128.91 69.22,127 A1.B1
N$57
  Top 0.406: A1A2SIDE1.8 95.25,123.19 81.92,123.19 80.64,121.92 74.3,121.92 73.03,120.65 A1.D1 70.48,120.65 68.58,118.75 66.04,118.75 64.14,120.65 A2.D1
N$58
  Bottom 0.406: A1A2SIDE1.12 95.25,118.11 76.83,118.11 76.2,117.47 A1.E1 72.39,117.47 70.48,119.38 67.94,119.38 66.04,117.47 A2.E1
N$59
  Bottom 0.406: A1A2SIDE1.14 97.16,114.3 99.06,116.2 99.06,128.91 91.44,136.53 58.42,136.53 50.8,128.91 50.8,114.94 53.34,112.39 55.88,112.39 56.52,113.03 | 56.52,113.03 57.78,114.3 A2.F1 | A1.F1 68.58,114.3 66.67,112.39 64.14,112.39 63.5,113.03 56.52,113.03
N$60
  Top 0.406: A1A2SIDE1.16 95.25,110.49 76.83,110.49 76.2,111.12 A1.H1
  Bottom 0.406: A2.H1 67.31,111.12 69.22,113.03 71.75,113.03 73.66,111.12 A1.H1
N$61
  Top 0.406: A1A2SIDE1.20 95.25,105.41 77.47,105.41 75.56,107.31 | 75.56,107.31 74.93,107.95 A1.J1 | A2.J1 64.14,107.95 69.22,102.87 71.12,102.87 75.56,107.31
N$62
  Top 0.406: A1A2SIDE1.18 97.79,107.95 97.79,93.34 97.16,92.71 78.74,92.71 76.2,90.17 73.66,90.17 66.67,97.16 64.14,97.16 57.15,90.17 56.52,90.17 55.24,91.44 55.24,94.61 62.87,102.23 62.87,104.78 A2.K1
  Bottom 0.406: A1.K1 71.75,104.78 69.85,106.68 67.31,106.68 66.67,106.05 64.77,106.05 63.5,104.78 A2.K1
N$63
  Bottom 0.406: A1A2SIDE1.24 99.06,99.06 99.06,88.27 82.55,71.75 55.88,71.75 49.53,78.11 49.53,89.53 52.07,92.08 52.07,95.89 56.52,100.33 58.42,100.33 | 58.42,100.33 59.69,101.6 A2.L1 | A1.L1 69.85,101.6 67.94,99.69 64.14,99.69 63.5,100.33 58.42,100.33
N$64  (via drill 0.81)
  Top 0.406: A2.M1 67.31,98.42 72.39,93.34 73.66,93.34 v75.56,95.25
  Bottom 0.406: A1A2SIDE1.28 95.25,95.25 95.25,88.27 94.61,87.63 93.34,87.63 90.17,90.81 90.17,97.16 87,100.33 78.11,100.33 76.2,98.42 A1.M1 75.56,98.42 v75.56,95.25
N$65  (via drill 0.81)
  Top 0.406: A1A2SIDE1.22 95.25,102.87 76.83,102.87 v73.03,99.06
  Bottom 0.406: 73.03,96.52 73.03,95.25 A1.N1 | 73.03,96.52 v73.03,99.06 | A2.N1 64.14,95.25 66.04,97.16 68.58,97.16 69.22,96.52 73.03,96.52
N$66
  Top 0.406: A1A2SIDE1.30 95.25,95.25 79.38,95.25 76.2,92.08 A1.P1
  Bottom 0.406: A2.P1 67.31,92.08 69.22,93.98 69.85,93.98 71.75,92.08 A1.P1
N$67
  Bottom 0.406: A1A2SIDE1.26 97.79,97.79 97.79,88.27 82.55,73.03 59.69,73.03 50.8,81.92 50.8,88.27 56.52,93.98 57.78,93.98 59.69,92.08 60.96,92.08 62.87,90.17 65.41,90.17 66.04,90.81 68.58,90.81 69.85,89.53 | 69.85,89.53 70.48,88.9 A1.R1 | A2.R1 61.59,88.9 62.87,87.63 65.41,87.63 66.04,87 67.31,87 69.85,89.53
N$68
  Top 0.406: A1A2SIDE1.32 95.25,90.17 80.64,90.17 76.2,85.72 A1.S1 73.66,85.72 71.75,87.63 69.22,87.63 67.31,85.72 A2.S1
N$69
  Top 0.406: A1A2SIDE1.34 90.17,82.55 A1.T1 70.48,82.55 68.58,84.45 66.04,84.45 64.14,82.55 A2.T1
N$70
  Top 0.406: A1A2SIDE1.4 95.25,128.27 78.74,128.27 76.2,125.73 73.66,125.73 69.85,121.92 67.31,121.92 63.5,125.73 62.87,125.73 52.07,114.94 52.07,88.27 60.96,79.38 A2.U1 65.41,79.38 67.31,81.28 69.85,81.28 71.75,79.38 A1.U1
N$71  (via drill 0.81)
  Top 0.406: v99.06,100.97 99.06,89.53 85.72,76.2 A1.V1 72.39,76.2 69.22,73.03 54.61,73.03 52.07,75.56 52.07,76.83 53.34,78.11 53.98,78.11 55.88,76.2 A2.V1
  Bottom 0.406: A1A2SIDE1.2 97.79,128.27 97.79,116.2 97.16,115.57 95.89,115.57 95.25,114.94 95.25,103.5 95.89,102.87 97.16,102.87 v99.06,100.97
N$72
  Top 0.406: A1A2SIDE1.11 A1A2SIDE1.9 | A1.C1 81.28,123.83 83.19,125.73 92.71,125.73 A1A2SIDE1.3
  Bottom 0.406: A2.C1 66.04,123.83 67.94,121.92 71.75,121.92 73.66,123.83 A1.C1 | A1A2SIDE1.9 A1A2SIDE1.7 A1A2SIDE1.5 A1A2SIDE1.3 A1A2SIDE1.1 | A1A2SIDE1.11 A1A2SIDE1.13 A1A2SIDE1.15 A1A2SIDE1.17 A1A2SIDE1.19 A1A2SIDE1.21 A1A2SIDE1.23 A1A2SIDE1.25 A1A2SIDE1.27 A1A2SIDE1.29 A1A2SIDE1.31 A1A2SIDE1.33
N$145  (via drill 0.81)
  Top 0.406: v24.13,125.73 6.35,125.73 A3A4SIDE2.3
  Bottom 0.406: A3.C2 39.37,123.83 37.47,125.73 34.92,125.73 33.02,123.83 A4.C2 26.04,123.83 v24.13,125.73 | A3A4SIDE2.1 A3A4SIDE2.3 A3A4SIDE2.5 A3A4SIDE2.7 A3A4SIDE2.9 A3A4SIDE2.11 A3A4SIDE2.13 A3A4SIDE2.15 A3A4SIDE2.17 A3A4SIDE2.19 A3A4SIDE2.21 A3A4SIDE2.23 A3A4SIDE2.25 A3A4SIDE2.27 A3A4SIDE2.29 A3A4SIDE2.31 A3A4SIDE2.33
N$146
  Bottom 0.406: A3A4SIDE2.2 10.16,132.08 26.67,132.08 | 26.67,132.08 28.57,130.18 A4.A2 | A3.A2 38.73,130.18 36.83,132.08 26.67,132.08
N$147
  Top 0.406: A3A4SIDE2.4 13.34,127 14.61,128.27 24.13,128.27 25.4,127 A4.B2
  Bottom 0.406: A3.B2 34.29,127 32.38,125.09 29.84,125.09 27.94,127 A4.B2
N$148
  Top 0.406: A3A4SIDE2.6 10.79,124.46 14.61,120.65 A4.D2
  Bottom 0.406: A3.D2 34.29,120.65 32.38,122.56 29.84,122.56 29.21,121.92 27.3,121.92 26.04,120.65 A4.D2
N$149
  Top 0.406: A3A4SIDE2.8 10.16,121.92 13.97,118.11 27.94,118.11 28.57,117.47 A4.E2 31.11,117.47 33.02,119.38 35.56,119.38 37.47,117.47 A3.E2
N$150
  Top 0.406: A3A4SIDE2.10 13.97,113.03 24.13,113.03 25.4,114.3 A4.F2
  Bottom 0.406: A3.F2 34.29,114.3 32.38,112.39 29.84,112.39 27.94,114.3 A4.F2
N$151
  Top 0.406: A3A4SIDE2.12 13.97,110.49 27.94,110.49 28.57,111.12 A4.H2
  Bottom 0.406: A3.H2 37.47,111.12 35.56,113.03 34.29,113.03 32.38,111.12 A4.H2
N$152
  Top 0.406: A3A4SIDE2.14 13.97,107.95 A4.J2
  Bottom 0.406: A3.J2 34.29,107.95 32.38,109.86 29.84,109.86 27.94,107.95 A4.J2
N$153
  Top 0.406: A3A4SIDE2.16 13.97,105.41 27.94,105.41 28.57,104.78 A4.K2
  Bottom 0.406: A3.K2 38.1,104.78 36.2,106.68 33.02,106.68 31.11,104.78 A4.K2
N$154
  Top 0.406: A3A4SIDE2.18 13.97,102.87 24.13,102.87 25.4,101.6 A4.L2
  Bottom 0.406: A4.L2 27.94,101.6 29.84,103.5 32.38,103.5 33.02,102.87 36.83,102.87 38.1,101.6 A3.L2
N$155
  Top 0.406: A3A4SIDE2.20 13.97,100.33 23.5,100.33 25.4,98.42 A4.M2
  Bottom 0.406: A3.M2 37.47,98.42 35.56,100.33 34.92,100.33 33.02,98.42 A4.M2
N$156
  Top 0.406: A3.N2 34.29,95.25 32.38,93.34 31.75,93.34 29.84,95.25 A4.N2
  Bottom 0.406: A3A4SIDE2.22 8.26,104.14 13.97,98.42 13.97,88.27 14.61,87.63 18.41,87.63 26.04,95.25 A4.N2
N$157
  Bottom 0.406: A3A4SIDE2.24 11.43,97.79 11.43,88.27 14.61,85.09 24.13,85.09 28.57,89.53 | 28.57,89.53 28.57,92.08 A4.P2 | A3.P2 37.47,92.08 35.56,93.98 33.02,93.98 28.57,89.53
N$158
  Top 0.406: A3.R2 34.29,88.9 32.38,90.81 29.84,90.81 27.94,88.9 A4.R2
  Bottom 0.406: A3A4SIDE2.26 6.35,100.33 6.35,102.23 6.99,102.87 8.26,102.87 12.7,98.42 12.7,88.27 14.61,86.36 22.86,86.36 25.4,88.9 A4.R2
N$159
  Bottom 0.406: A3A4SIDE2.28 10.16,93.98 10.16,88.27 14.61,83.82 24.77,83.82 26.67,85.72 A4.S2 31.11,85.72 33.02,87.63 35.56,87.63 37.47,85.72 A3.S2
N$160
  Top 0.406: A3A4SIDE2.30 19.05,82.55 A4.T2
  Bottom 0.406: A3.T2 34.29,82.55 32.38,84.45 29.84,84.45 27.94,82.55 A4.T2
N$161
  Bottom 0.406: A3A4SIDE2.34 17.14,79.38 A4.U2 31.11,79.38 33.02,81.28 35.56,81.28 36.2,80.64 40.01,80.64 41.27,79.38 A3.U2
N$162
  Top 0.406: A3A4SIDE2.32 8.89,91.44 24.13,76.2 A4.V2
  Bottom 0.406: A3.V2 35.56,76.2 33.66,74.3 27.94,74.3 26.04,76.2 A4.V2
N$163
  Bottom 0.406: A3A4SIDE1.10 22.86,124.46 22.86,126.36 25.4,128.91 27.94,128.91 28.57,128.27 31.11,128.27 33.02,130.18 A4.A1 37.47,130.18 39.37,128.27 41.91,128.27 43.81,130.18 A3.A1
N$164
  Top 0.406: A3A4SIDE1.6 24.77,124.46 25.4,125.09 26.04,125.09 27.94,127 A4.B1 34.29,127 36.2,125.09 38.73,125.09 40.64,127 A3.B1
N$165
  Top 0.406: A3A4SIDE1.8 24.77,121.92 25.4,122.56 27.94,122.56 29.84,120.65 A4.D1 34.29,120.65 36.2,122.56 38.73,122.56 40.64,120.65 A3.D1
N$166
  Bottom 0.406: A3A4SIDE1.12 24.77,116.84 25.4,117.47 26.67,117.47 28.57,119.38 29.84,119.38 31.75,117.47 A4.E1 38.73,117.47 40.64,115.57 41.91,115.57 43.81,117.47 A3.E1
N$167
  Bottom 0.406: A3A4SIDE1.14 23.5,114.3 25.4,116.2 27.94,116.2 28.57,115.57 | 28.57,115.57 29.84,114.3 A4.F1 | A3.F1 40.64,114.3 38.73,116.2 36.2,116.2 35.56,115.57 28.57,115.57
N$168
  Top 0.406: A3A4SIDE1.16 27.3,111.76 28.57,113.03 31.11,113.03 33.02,111.12 A4.H1
  Bottom 0.406: A3.H1 43.81,111.12 41.91,109.22 39.37,109.22 38.73,109.86 36.83,109.86 35.56,111.12 A4.H1
N$169
  Top 0.406: A3.J1 40.64,107.95 38.73,109.86 36.2,109.86 34.29,107.95 A4.J1
  Bottom 0.406: A3A4SIDE1.20 16.51,107.95 16.51,109.86 17.14,110.49 20.95,110.49 25.4,106.05 27.94,106.05 29.84,107.95 A4.J1
N$170
  Bottom 0.406: A3A4SIDE1.18 24.13,102.87 24.13,100.97 25.4,99.69 27.94,99.69 28.57,100.33 31.11,100.33 31.75,99.69 33.02,99.69 34.92,101.6 36.2,101.6 38.1,99.69 40.64,99.69 41.91,100.97 | 41.91,100.97 45.72,104.78 A3.K1 | A4.K1 36.83,104.78 38.1,103.5 39.37,103.5 41.91,100.97
N$171
  Top 0.406: A3A4SIDE1.24 23.5,101.6 25.4,99.69 27.94,99.69 29.84,101.6 | A4.L1 29.84,101.6 | A3.L1 40.64,101.6 35.56,106.68 34.92,106.68 29.84,101.6
N$172
  Top 0.406: A3A4SIDE1.28 24.77,96.52 25.4,97.16 27.94,97.16 28.57,96.52 31.11,96.52 33.02,98.42 A4.M1
  Bottom 0.406: A3.M1 43.81,98.42 41.91,96.52 39.37,96.52 38.73,97.16 36.83,97.16 35.56,98.42 A4.M1
N$173
  Bottom 0.406: A3A4SIDE1.22 19.68,104.14 28.57,95.25 A4.N1 35.56,95.25 37.47,93.34 38.73,93.34 40.64,95.25 A3.N1
N$174
  Top 0.406: A3A4SIDE1.30 24.77,93.98 25.4,93.34 27.94,93.34 28.57,93.98 29.84,93.98 31.75,92.08 A4.P1 37.47,92.08 39.37,93.98 41.91,93.98 43.81,92.08 A3.P1
N$175
  Top 0.406: A3A4SIDE1.26 16.51,97.79 16.51,93.34 17.14,92.71 19.68,92.71 25.4,87 27.94,87 29.84,88.9 A4.R1
  Bottom 0.406: A3.R1 40.64,88.9 38.73,90.81 36.2,90.81 34.29,88.9 A4.R1
N$176
  Top 0.406: A3A4SIDE1.32 23.5,85.72 26.67,85.72 28.57,83.82 31.11,83.82 33.02,85.72 A4.S1 37.47,85.72 39.37,87.63 41.91,87.63 43.81,85.72 A3.S1
N$177
  Top 0.406: A3A4SIDE1.34 19.05,88.9 23.5,84.45 26.67,84.45 28.57,82.55 A4.T1 34.29,82.55 36.2,84.45 38.73,84.45 40.64,82.55 A3.T1
N$178
  Bottom 0.406: A3A4SIDE1.4 16.51,125.73 16.51,118.75 17.14,118.11 24.77,118.11 25.4,118.75 26.67,118.75 28.57,120.65 29.84,120.65 31.75,118.75 34.29,118.75 34.92,119.38 37.47,119.38 38.1,118.75 40.64,118.75 44.45,122.56 45.09,122.56 49.53,118.11 49.53,90.81 46.35,87.63 46.35,80.64 | 46.35,80.64 47.62,79.38 A3.U1 | A4.U1 39.37,79.38 41.27,77.47 43.18,77.47 46.35,80.64
N$179
  Bottom 0.406: A3A4SIDE1.2 16.51,130.81 10.79,130.81 8.26,128.27 6.99,128.27 6.35,128.91 6.35,130.18 5.71,130.81 4.45,130.81 3.81,130.18 3.81,88.27 13.97,78.11 27.94,78.11 29.84,76.2 A4.V1 34.29,76.2 36.2,78.11 38.73,78.11 40.64,76.2 A3.V1
N$180
  Top 0.406: A4.C1 31.11,123.83 29.21,125.73 27.94,125.73 26.04,123.83 25.4,123.83 24.77,123.19 16.51,123.19 A3A4SIDE1.5
  Bottom 0.406: A4.C1 38.1,123.83 40.01,121.92 42.55,121.92 44.45,123.83 A3.C1 | A3A4SIDE1.1 A3A4SIDE1.3 A3A4SIDE1.5 A3A4SIDE1.7 A3A4SIDE1.9 A3A4SIDE1.11 A3A4SIDE1.13 A3A4SIDE1.15 A3A4SIDE1.17 A3A4SIDE1.19 A3A4SIDE1.21 A3A4SIDE1.23 A3A4SIDE1.25 A3A4SIDE1.27 A3A4SIDE1.29 A3A4SIDE1.31 A3A4SIDE1.33
N$253
  Top 0.406: B3.C2 43.81,53.98 46.35,56.52 46.35,59.05 41.91,63.5 7.62,63.5 B3B4SIDE2.1
  Bottom 0.406: B4.C2 33.02,53.98 34.92,55.88 37.47,55.88 39.37,53.98 B3.C2 | B3B4SIDE2.1 B3B4SIDE2.3 B3B4SIDE2.5 B3B4SIDE2.7 B3B4SIDE2.9 B3B4SIDE2.11 B3B4SIDE2.13 B3B4SIDE2.15 B3B4SIDE2.17 B3B4SIDE2.19 B3B4SIDE2.21 B3B4SIDE2.23 B3B4SIDE2.25 B3B4SIDE2.27 B3B4SIDE2.29 B3B4SIDE2.31 B3B4SIDE2.33
N$254
  Bottom 0.406: B3B4SIDE2.2 13.34,60.96 14.61,62.23 26.67,62.23 | 26.67,62.23 28.57,60.33 B4.A2 | B3.A2 37.47,60.33 35.56,62.23 26.67,62.23
N$255
  Top 0.406: B3B4SIDE2.4 10.79,58.42 14.61,62.23 20.32,62.23 | 20.32,62.23 25.4,57.15 B4.B2 | 20.32,62.23 29.21,62.23 33.02,58.42 36.83,58.42 38.1,57.15 B3.B2
N$256
  Top 0.406: B3B4SIDE2.6 10.79,55.88 14.61,52.07 24.13,52.07 25.4,50.8 B4.D2
  Bottom 0.406: B3.D2 34.29,50.8 32.38,52.7 29.84,52.7 27.94,50.8 B4.D2
N$257
  Top 0.406: B3B4SIDE2.8 12.7,48.26 13.34,48.26 14.61,49.53 24.77,49.53 26.67,47.62 B4.E2
  Bottom 0.406: B3.E2 37.47,47.62 35.56,49.53 33.02,49.53 31.11,47.62 B4.E2
N$258
  Top 0.406: B3B4SIDE2.10 8.89,50.8 13.34,46.35 13.97,46.35 14.61,46.99 22.86,46.99 25.4,44.45 B4.F2
  Bottom 0.406: B3.F2 34.29,44.45 32.38,42.55 29.84,42.55 27.94,44.45 B4.F2
N$259
  Top 0.406: B3B4SIDE2.12 10.16,48.26 13.97,44.45 23.5,44.45 26.67,41.27 B4.H2
  Bottom 0.406: B3.H2 37.47,41.27 35.56,43.18 34.29,43.18 32.38,41.27 B4.H2
N$260
  Top 0.406: B3B4SIDE2.14 13.97,39.37 24.13,39.37 25.4,38.1 B4.J2 27.94,38.1 29.84,36.2 32.38,36.2 34.29,38.1 B3.J2
N$261
  Top 0.406: B3B4SIDE2.16 13.97,36.83 24.77,36.83 26.67,34.92 B4.K2
  Bottom 0.406: B3.K2 37.47,34.92 35.56,36.83 33.02,36.83 31.11,34.92 B4.K2
N$262
  Top 0.406: B3B4SIDE2.18 13.97,34.29 22.86,34.29 25.4,31.75 B4.L2
  Bottom 0.406: B3.L2 34.29,31.75 32.38,29.84 29.84,29.84 27.94,31.75 B4.L2
N$263
  Bottom 0.406: B3B4SIDE2.20 13.97,31.75 13.97,19.68 14.61,19.05 21.59,19.05 28.57,26.04 28.57,28.57 B4.M2 32.38,28.57 34.29,30.48 35.56,30.48 37.47,28.57 B3.M2
N$264
  Top 0.406: B4.N2 29.84,25.4 31.75,27.3 34.29,27.3 36.2,25.4 B3.N2
  Bottom 0.406: B3B4SIDE2.22 12.7,30.48 12.7,19.68 14.61,17.78 22.23,17.78 31.75,27.3 34.29,27.3 36.2,25.4 B3.N2
N$265
  Bottom 0.406: B3B4SIDE2.24 11.43,29.21 11.43,19.68 14.61,16.51 25.4,16.51 28.57,19.68 28.57,22.23 B4.P2 33.02,22.23 34.92,20.32 35.56,20.32 37.47,22.23 B3.P2
N$266
  Top 0.406: B4.R2 29.84,19.05 31.75,20.95 34.29,20.95 36.2,19.05 B3.R2
  Bottom 0.406: B3B4SIDE2.26 10.16,27.94 10.16,19.68 14.61,15.24 26.04,15.24 31.75,20.95 33.02,20.95 34.92,19.05 B3.R2
N$267
  Bottom 0.406: B3B4SIDE2.28 6.35,26.67 6.35,19.68 15.24,10.79 26.04,10.79 28.57,13.34 28.57,15.88 B4.S2 31.11,15.88 33.02,13.97 35.56,13.97 37.47,15.88 B3.S2
N$268
  Top 0.406: B3B4SIDE2.30 20.32,12.7 B4.T2 26.04,12.7 27.3,11.43 29.21,11.43 29.84,10.79 32.38,10.79 34.29,12.7 B3.T2
N$269
  Top 0.406: B3B4SIDE2.34 11.43,20.32 22.23,9.53 B4.U2
  Bottom 0.406: B3.U2 37.47,9.53 35.56,7.62 33.02,7.62 31.11,9.53 B4.U2
N$270
  Top 0.406: B3B4SIDE2.32 6.35,21.59 6.35,19.68 19.68,6.35 B4.V2
  Bottom 0.406: B3.V2 34.29,6.35 32.38,4.45 27.94,4.45 26.04,6.35 B4.V2
N$271
  Bottom 0.406: B3B4SIDE1.10 22.23,50.8 30.48,59.05 | 30.48,59.05 31.75,60.33 B4.A1 | B3.A1 43.81,60.33 41.91,58.42 39.37,58.42 38.73,59.05 30.48,59.05
N$272
  Top 0.406: B3.B1 40.64,57.15 38.73,55.24 38.1,55.24 36.2,57.15 B4.B1
  Bottom 0.406: B3B4SIDE1.6 16.51,54.61 16.51,50.16 17.14,49.53 22.23,49.53 29.84,57.15 B4.B1
N$273
  Top 0.406: B3B4SIDE1.8 26.04,53.34 28.57,50.8 29.84,50.8 | B4.D1 29.84,50.8 | B3.D1 40.64,50.8 35.56,45.72 34.92,45.72 29.84,50.8
N$274
  Bottom 0.406: B3B4SIDE1.12 26.04,48.26 28.57,45.72 31.11,45.72 31.75,46.35 | 31.75,46.35 33.02,47.62 B4.E1 | B3.E1 43.81,47.62 41.91,45.72 39.37,45.72 38.73,46.35 31.75,46.35
N$275
  Top 0.406: B4.F1 36.2,44.45 38.1,46.35 40.64,46.35 42.55,44.45 B3.F1
  Bottom 0.406: B3B4SIDE1.14 24.13,39.37 24.13,37.47 28.57,33.02 31.11,33.02 31.75,33.66 34.29,33.66 34.92,33.02 37.47,33.02 38.1,33.66 40.64,33.66 41.27,33.02 41.91,33.02 46.35,37.47 46.35,43.18 45.09,44.45 B3.F1
N$276
  Top 0.406: B3B4SIDE1.16 23.5,43.18 27.3,39.37 31.11,39.37 33.02,41.27 B4.H1
  Bottom 0.406: B3.H1 47.62,41.27 47.62,43.81 45.09,46.35 44.45,46.35 43.18,45.09 43.18,40.64 41.91,39.37 39.37,39.37 38.73,40.01 36.83,40.01 35.56,41.27 B4.H1
N$277
  Bottom 0.406: B3B4SIDE1.20 16.51,39.37 16.51,46.35 17.14,46.99 20.95,46.99 29.84,38.1 B4.J1 35.56,38.1 37.47,36.2 38.73,36.2 40.64,38.1 B3.J1
N$278  (via drill 0.81)
  Top 0.406: v26.04,33.66 27.94,33.66 28.57,33.02 31.11,33.02 33.02,34.92 B4.K1 37.47,34.92 39.37,36.83 41.91,36.83 43.81,34.92 B3.K1
  Bottom 0.406: B3B4SIDE1.18 19.05,40.64 v26.04,33.66
N$279
  Top 0.406: B3B4SIDE1.24 22.23,33.02 25.4,29.84 27.94,29.84 29.84,31.75 B4.L1 34.29,31.75 36.2,33.66 38.73,33.66 40.64,31.75 B3.L1
N$280
  Top 0.406: B3B4SIDE1.28 27.3,27.94 28.57,26.67 29.84,26.67 31.75,28.57 B4.M1
  Bottom 0.406: B3.M1 43.81,28.57 41.91,26.67 39.37,26.67 38.73,27.3 36.83,27.3 35.56,28.57 B4.M1
N$281  (via drill 0.81)
  Top 0.406: v24.13,24.13 24.77,24.13 25.4,23.5 27.94,23.5 28.57,24.13 30.48,24.13 31.75,25.4 B4.N1
  Bottom 0.406: B3B4SIDE1.22 24.13,29.21 v24.13,24.13 | B3.N1 40.64,25.4 38.73,23.5 36.2,23.5 34.29,25.4 B4.N1
N$282
  Top 0.406: B3B4SIDE1.30 20.95,25.4 25.4,20.95 27.94,20.95 28.57,20.32 29.84,20.32 31.75,22.23 B4.P1 37.47,22.23 39.37,24.13 41.91,24.13 43.81,22.23 B3.P1
N$283
  Top 0.406: B3B4SIDE1.26 16.51,29.21 16.51,24.77 17.14,24.13 18.41,24.13 25.4,17.14 27.94,17.14 28.57,17.78 30.48,17.78 31.75,19.05 B4.R1 34.29,19.05 36.2,17.14 38.73,17.14 40.64,19.05 B3.R1
N$284
  Top 0.406: B3B4SIDE1.32 19.05,21.59 19.68,21.59 25.4,15.88 26.67,15.88 28.57,13.97 31.11,13.97 33.02,15.88 B4.S1
  Bottom 0.406: B3.S1 43.81,15.88 41.91,17.78 39.37,17.78 38.73,17.14 36.83,17.14 35.56,15.88 B4.S1
N$285
  Top 0.406: B3B4SIDE1.34 19.68,20.32 25.4,14.61 26.67,14.61 28.57,12.7 B4.T1
  Bottom 0.406: B3.T1 40.64,12.7 38.73,14.61 37.47,14.61 35.56,12.7 B4.T1
N$286
  Top 0.406: B3B4SIDE1.4 16.51,57.15 4.45,57.15 3.81,56.52 3.81,19.68 19.05,4.45 27.94,4.45 33.02,9.53 B4.U1
  Bottom 0.406: B3.U1 43.81,9.53 41.91,11.43 39.37,11.43 38.73,10.79 36.83,10.79 35.56,9.53 B4.U1
N$287
  Top 0.406: B3B4SIDE1.2 19.68,60.96 28.57,52.07 31.11,52.07 34.92,55.88 36.2,55.88 40.01,52.07 43.81,52.07 44.45,52.7 45.09,52.7 49.53,48.26 49.53,19.68 | 49.53,19.68 49.53,13.34 45.09,8.89 45.09,6.35 B3.V1 | B4.V1 36.2,6.35 49.53,19.68
N$288
  Bottom 0.406: B4.C1 38.1,53.98 40.01,52.07 43.81,52.07 45.72,53.98 B3.C1 48.26,53.98 48.26,58.42 49.53,59.69 49.53,60.96 46.99,63.5 8.26,63.5 6.35,61.59 6.35,60.33 6.99,59.69 15.24,59.69 | 15.24,59.69 B3B4SIDE1.3 B3B4SIDE1.5 B3B4SIDE1.7 B3B4SIDE1.9 B3B4SIDE1.11 B3B4SIDE1.13 B3B4SIDE1.15 B3B4SIDE1.17 B3B4SIDE1.19 B3B4SIDE1.21 B3B4SIDE1.23 B3B4SIDE1.25 B3B4SIDE1.27 B3B4SIDE1.29 B3B4SIDE1.31 B3B4SIDE1.33 | 15.24,59.69 B3B4SIDE1.1

### Text on the board
tPlace: A4 | A3 | A2 | A1 | 1 | 1 | 1 | 1 | 34 | 34 | 34 | 34 | A4 | A3 | A2 | A1 | B4 | B3 | B2 | B1 | 1 | 1 | 1 | 1 | 34 | 34 | 34 | 34 | B4 | B3 | B2 | B1
bPlace: 2 | 1 | 2 | 1 | 2 | 1 | 2 | 1 | A | A | A | A | B | B | B | B | C | C | C | C | D | D | D | D | E | E | E | E | F | F | F | F | H | H | H | H | J | J | J | J | K | K | K | K | L | L | L | L | M | M | M | M | N | N | N | N | P | P | P | P | R | R | R | R | S | S | S | S | T | T | T | T | U | U | U | U | V | V | V | V | 2 | 1 | 2 | 1 | 2 | 1 | 2 | 1 | 2 | 1 | 2 | 1 | 2 | 1 | 2 | 1 | A | A | A | A | B | B | B | B | C | C | C | C | D | D | D | D | E | E | E | E | F | F | F | F | H | H | H | H | J | J | J | J | K | K | K | K | L | L | L | L | M | M | M | M | N | N | N | N | P | P | P | P | R | R | R | R | S | S | S | S | T | T | T | T | U | U | U | U | V | V | V | V | 2 | 1 | 2 | 1 | 2 | 1 | 2 | 1
tNames: A3A4SIDE2 | A3A4SIDE1 | A1A2SIDE2 | A1A2SIDE1 | B3B4SIDE2 | B3B4SIDE1 | B1B2SIDE2 | B1B2SIDE1